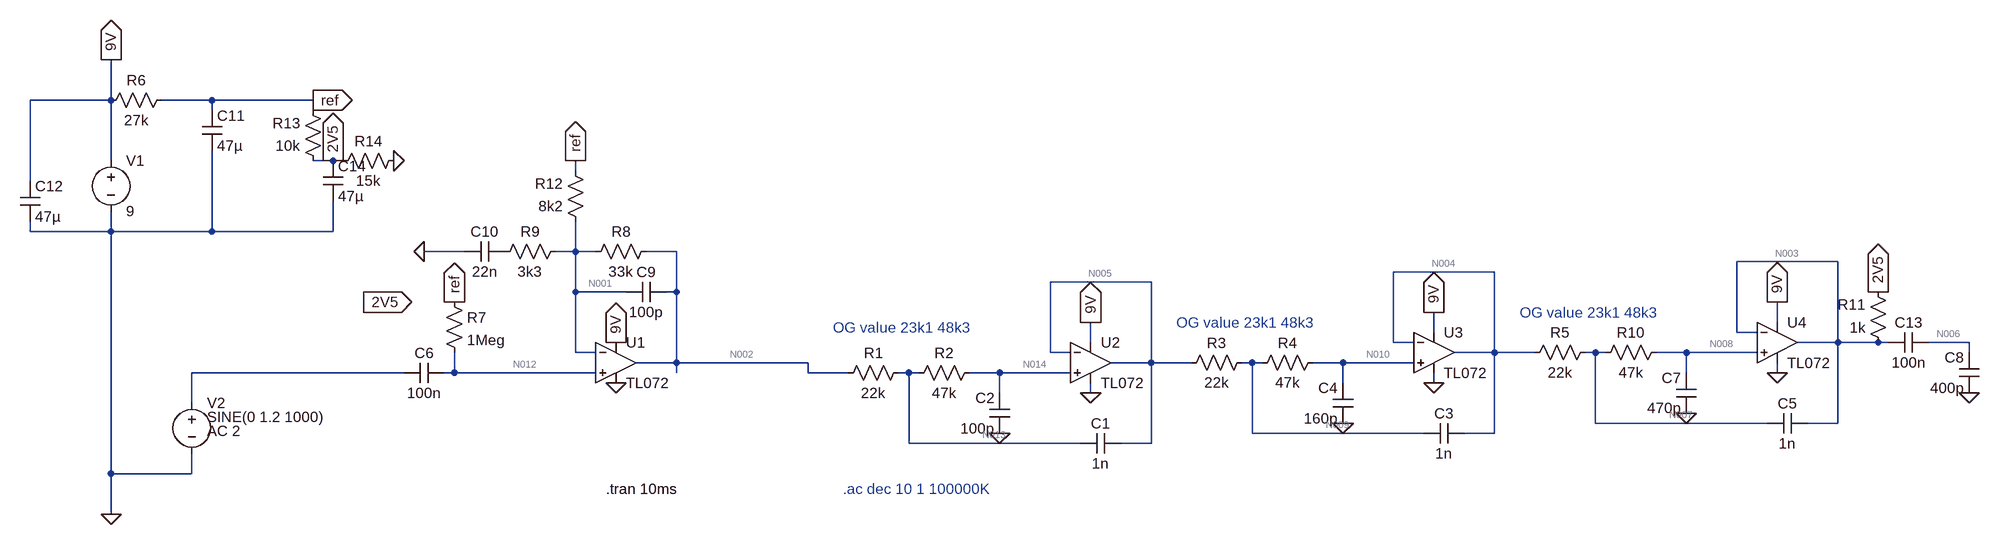
[diagram p0: schematic Butterworth_input_filter_v2.asc]
* Butterworth_input_filter_v2.asc
V1 9V 0 9
V2 N011 0 SINE(0 1.2 1000) AC 2
R1 N013 N002 22k
R2 N014 N013 47k
C1 N005 N013 1n
C2 0 N014 100p
R3 N009 N005 22k
R4 N010 N009 47k
C3 N004 N009 1n
C4 0 N010 160p
C6 N012 N011 100n
R7 ref N012 1Meg
R8 N002 N001 33k
R9 N001 P001 3k3
* U1: TL072 (symbol TL072 not available, pins judged from their places): In+=N012 In-=N001 V+=9V V-=0 OUT=N002
* U2: TL072 (symbol TL072 not available, pins judged from their places): In+=N014 In-=N005 V+=9V V-=0 OUT=N005
* U3: TL072 (symbol TL072 not available, pins judged from their places): In+=N010 In-=N004 V+=9V V-=0 OUT=N004
R5 N007 N004 22k
R10 N008 N007 47k
C5 N003 N007 1n
C7 0 N008 470p
* U4: TL072 (symbol TL072 not available, pins judged from their places): In+=N008 In-=N003 V+=9V V-=0 OUT=N003
C8 0 N006 400p
R11 N003 2V5 1k
R12 N001 ref 8k2
C9 N001 N002 100p
R6 ref 9V 27k
R13 2V5 ref 10k
R14 2V5 0 15k
C10 P001 0 22n
C11 ref 0 47µ
C12 9V 0 47µ
C13 N006 N003 100n
C14 2V5 0 47µ
* .ac dec 10 1 100000K
* OG value 23k1 48k3
* OG value 23k1 48k3
.tran 10ms
* OG value 23k1 48k3
.backanno
.end

* Results of the author's LTspice run, read from the files saved beside the schematic
* Operating Point, zero values left out:
*   V(9v) = 9 V
*   V(n013) = 7.388 V
*   V(n002) = 7.388 V
*   V(n014) = 7.388 V
*   V(n005) = 7.376 V
*   V(n009) = 7.376 V
*   V(n010) = 7.376 V
*   V(n004) = 7.367 V
*   V(n012) = 7.487 V
*   V(ref) = 7.487 V
*   V(n001) = 7.467 V
*   V(p001) = 7.467 V
*   V(n007) = 7.367 V
*   V(n008) = 7.367 V
*   V(n003) = 7.36 V
*   V(n006) = 736 nV
*   V(2v5) = 6.95 V
*   I(R1) = -37.46 pA
*   I(R2) = -37.46 pA
*   I(R3) = -37.45 pA
*   I(R4) = -37.45 pA
*   I(R7) = 37.57 pA
*   I(R8) = -2.401 µA
*   I(R5) = -37.44 pA
*   I(R10) = -37.44 pA
*   I(R11) = 409.7 µA
*   I(R12) = -2.401 µA
*   I(R6) = -56.04 µA
*   I(R13) = -53.64 µA
*   I(R14) = 463.4 µA
*   I(V1) = -17.62 mA
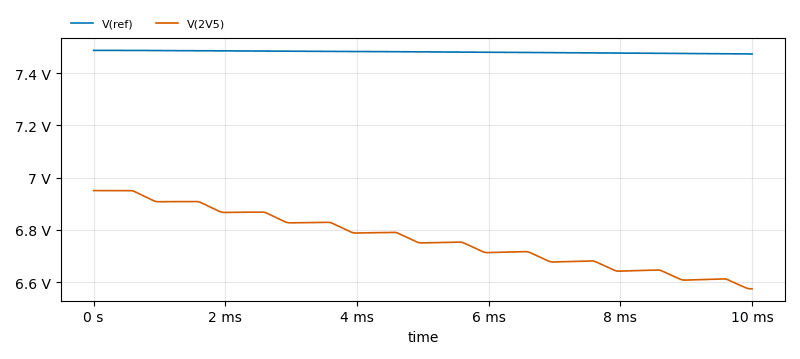
[diagram p1: Transient Analysis of Butterworth_input_filter_v2.asc, plotted from the saved traces]
* Transient Analysis, 1 run:
*   V(ref): min 7.473 V, max 7.487 V, average 7.481 V, rms 7.481 V, last 7.473 V
*   V(2V5): min 6.575 V, max 6.951 V, average 6.766 V, rms 6.767 V, last 6.575 V